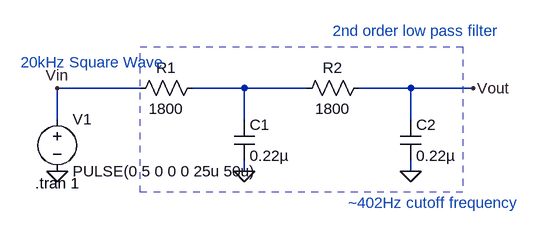
[diagram p0: schematic PWM to Analog Filter.asc]
PWM to Analog Filter.asc, the LTspice schematic file:
Version 4
SHEET 1 880 680
WIRE 112 96 -16 96
WIRE 272 96 192 96
WIRE 368 96 272 96
WIRE 528 96 448 96
WIRE 624 96 528 96
WIRE -16 144 -16 96
WIRE 272 144 272 96
WIRE 528 144 528 96
WIRE 272 224 272 208
WIRE 528 224 528 208
FLAG -16 224 0
FLAG 272 224 0
FLAG 528 224 0
FLAG 624 96 Vout
FLAG -16 96 Vin
SYMBOL voltage -16 128 R0
WINDOW 123 0 0 Left 0
WINDOW 39 0 0 Left 0
SYMATTR InstName V1
SYMATTR Value PULSE(0 5 0 0 0 25u 50u)
SYMBOL cap 256 144 R0
SYMATTR InstName C1
SYMATTR Value 0.22µ
SYMBOL res 208 80 R90
WINDOW 0 0 56 VBottom 2
WINDOW 3 32 56 VTop 2
SYMATTR InstName R1
SYMATTR Value 1800
SYMBOL cap 512 144 R0
SYMATTR InstName C2
SYMATTR Value 0.22µ
SYMBOL res 464 80 R90
WINDOW 0 0 56 VBottom 2
WINDOW 3 32 56 VTop 2
SYMATTR InstName R2
SYMATTR Value 1800
TEXT -50 242 Left 2 !.tran 1
TEXT -72 56 Left 2 ;20kHz Square Wave
TEXT 408 8 Left 2 ;2nd order low pass filter
TEXT 432 272 Left 2 ;~402Hz cutoff frequency
RECTANGLE Normal 608 256 112 32 2

The netlist it stands for:
* PWM to Analog Filter.asc
V1 Vin 0 PULSE(0 5 0 0 0 25u 50u)
C1 N001 0 0.22µ
R1 N001 Vin 1800
C2 Vout 0 0.22µ
R2 Vout N001 1800
.tran 1
* 20kHz Square Wave
* 2nd order low pass filter
* ~402Hz cutoff frequency
.backanno
.end